# EAGLE design working (EAGLE 6.5.0)
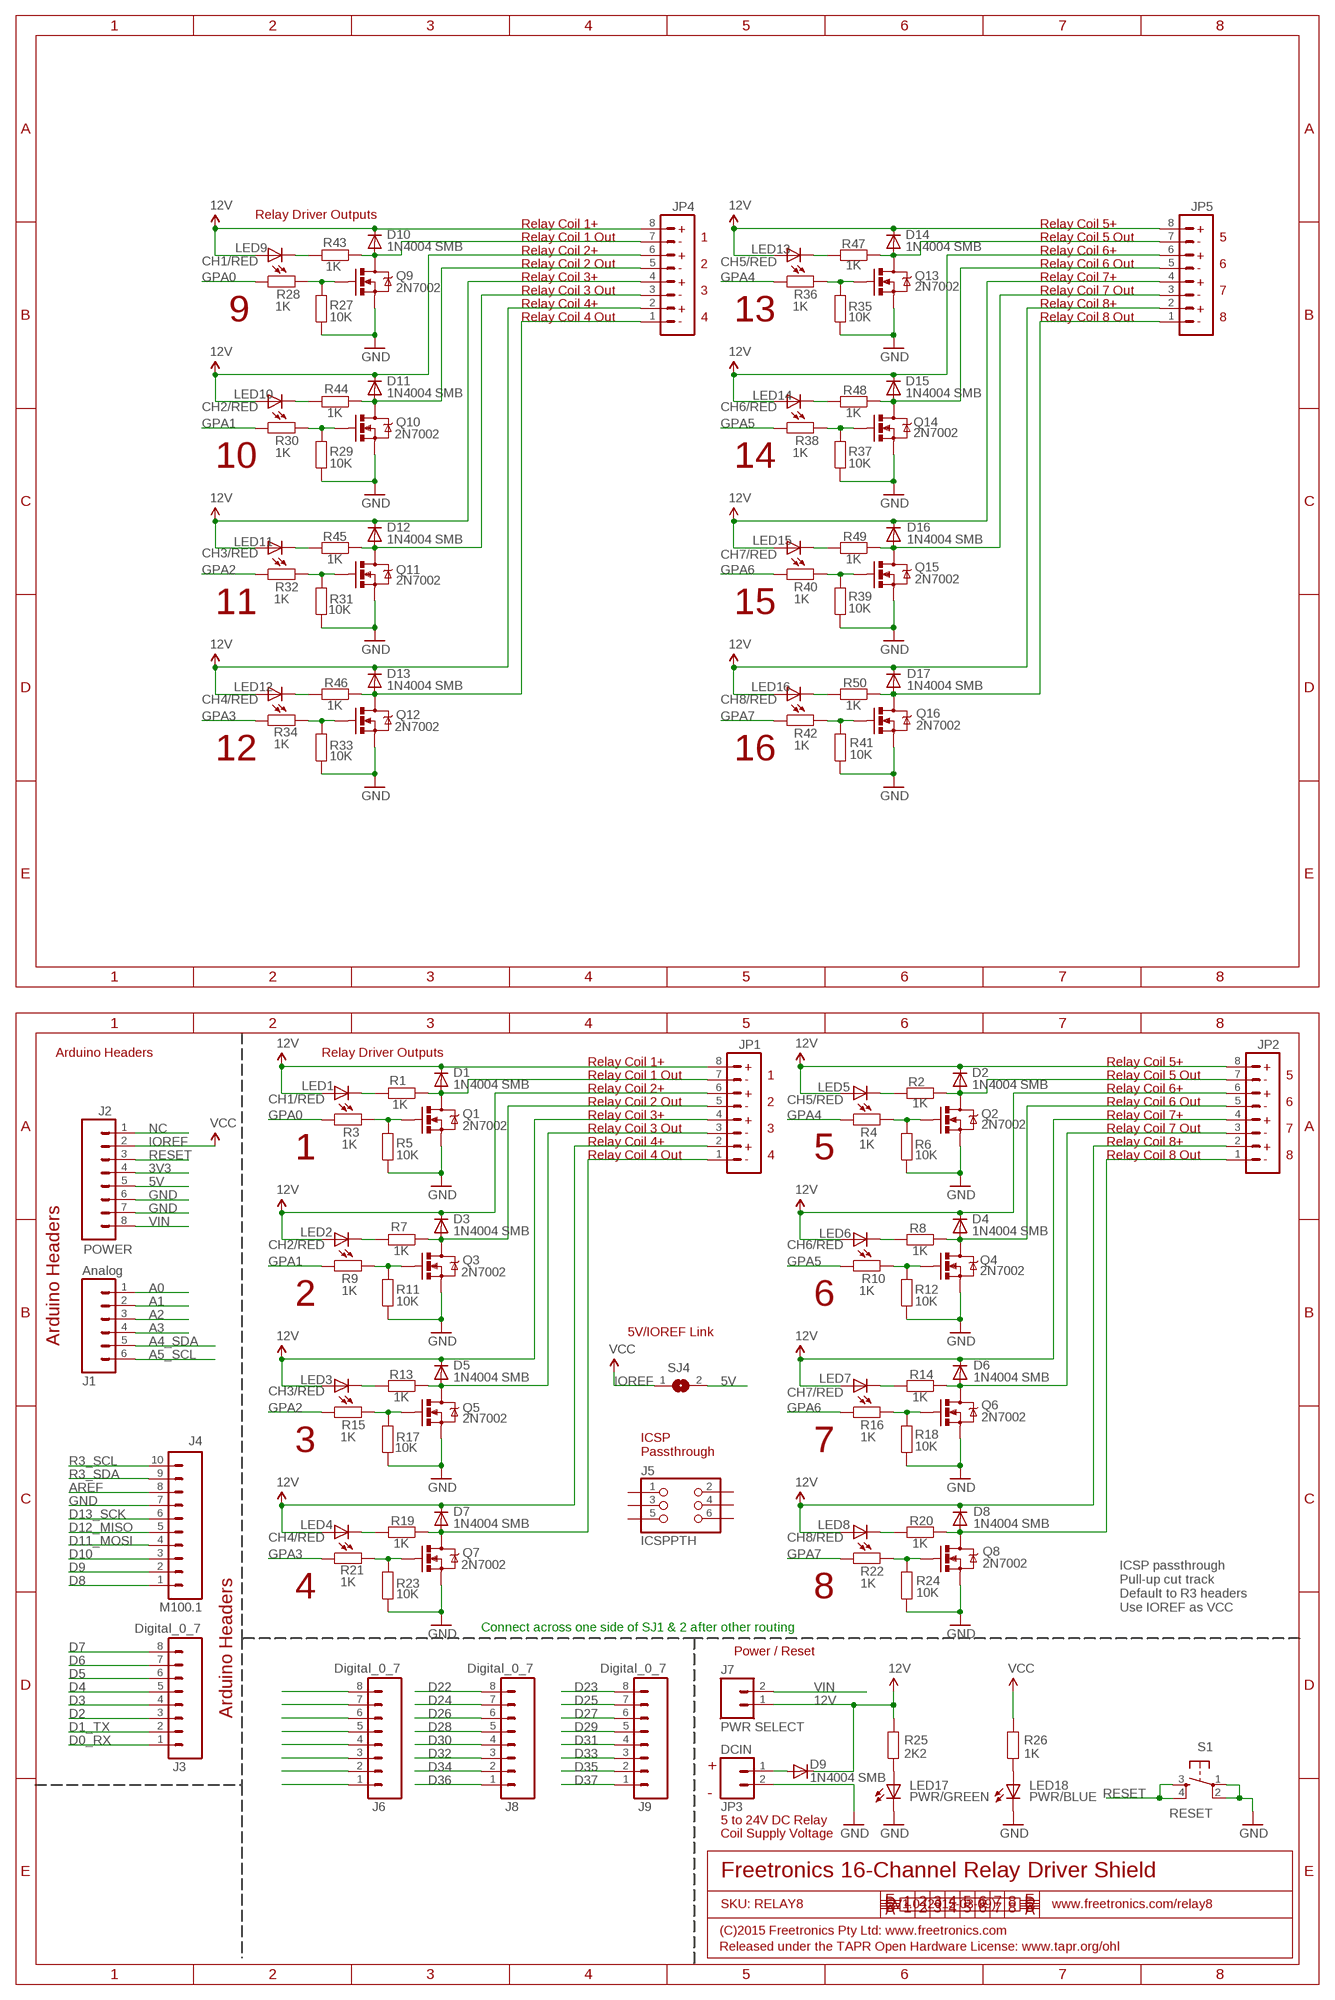
[diagram p0: schematic, sheet 1]

## Parts
D1  1N4004 SMB  DIODESMB  [SMB-DIODE]
D2  1N4004 SMB  DIODESMB  [SMB-DIODE]
D3  1N4004 SMB  DIODESMB  [SMB-DIODE]
D4  1N4004 SMB  DIODESMB  [SMB-DIODE]
D5  1N4004 SMB  DIODESMB  [SMB-DIODE]
D6  1N4004 SMB  DIODESMB  [SMB-DIODE]
D7  1N4004 SMB  DIODESMB  [SMB-DIODE]
D8  1N4004 SMB  DIODESMB  [SMB-DIODE]
D9  1N4004 SMB  DIODESMB  [SMB-DIODE]
D10  1N4004 SMB  DIODESMB  [SMB-DIODE]
D11  1N4004 SMB  DIODESMB  [SMB-DIODE]
D12  1N4004 SMB  DIODESMB  [SMB-DIODE]
D13  1N4004 SMB  DIODESMB  [SMB-DIODE]
D14  1N4004 SMB  DIODESMB  [SMB-DIODE]
D15  1N4004 SMB  DIODESMB  [SMB-DIODE]
D16  1N4004 SMB  DIODESMB  [SMB-DIODE]
D17  1N4004 SMB  DIODESMB  [SMB-DIODE]
J1  Analog  M06SIP  [1X06]
J2  POWER  M08  [1X08]
J3  Digital_0_7  M08  [1X08]
J4  M100.1  [1X10]
J5  ICSPPTH  [2X03PTH]
J6  Digital_0_7  M08  [1X08]
J7  PWR SELECT  M02PTH  [1X02]
J8  Digital_0_7  M08  [1X08]
J9  Digital_0_7  M08  [1X08]
JP1  M08  [TERMINALBLOCK_3.5MM_8]
JP2  M08  [TERMINALBLOCK_3.5MM_8]
JP3  DCIN  M023.5MM  [SCREWTERMINAL-3.5MM-2]
JP4  M08  [TERMINALBLOCK_3.5MM_8]
JP5  M08  [TERMINALBLOCK_3.5MM_8]
LED1  CH1/RED  LED0603  [LED-0603]
LED2  CH2/RED  LED0603  [LED-0603]
LED3  CH3/RED  LED0603  [LED-0603]
LED4  CH4/RED  LED0603  [LED-0603]
LED5  CH5/RED  LED0603  [LED-0603]
LED6  CH6/RED  LED0603  [LED-0603]
LED7  CH7/RED  LED0603  [LED-0603]
LED8  CH8/RED  LED0603  [LED-0603]
LED9  CH1/RED  LED0603  [LED-0603]
LED10  CH2/RED  LED0603  [LED-0603]
LED11  CH3/RED  LED0603  [LED-0603]
LED12  CH4/RED  LED0603  [LED-0603]
LED13  CH5/RED  LED0603  [LED-0603]
LED14  CH6/RED  LED0603  [LED-0603]
LED15  CH7/RED  LED0603  [LED-0603]
LED16  CH8/RED  LED0603  [LED-0603]
LED17  PWR/GREEN  LED0603  [LED-0603]
LED18  PWR/BLUE  LED0603  [LED-0603]
Q1  2N7002  MOSFET-NCHANNELSMD  [SOT23-3]
Q2  2N7002  MOSFET-NCHANNELSMD  [SOT23-3]
Q3  2N7002  MOSFET-NCHANNELSMD  [SOT23-3]
Q4  2N7002  MOSFET-NCHANNELSMD  [SOT23-3]
Q5  2N7002  MOSFET-NCHANNELSMD  [SOT23-3]
Q6  2N7002  MOSFET-NCHANNELSMD  [SOT23-3]
Q7  2N7002  MOSFET-NCHANNELSMD  [SOT23-3]
Q8  2N7002  MOSFET-NCHANNELSMD  [SOT23-3]
Q9  2N7002  MOSFET-NCHANNELSMD  [SOT23-3]
Q10  2N7002  MOSFET-NCHANNELSMD  [SOT23-3]
Q11  2N7002  MOSFET-NCHANNELSMD  [SOT23-3]
Q12  2N7002  MOSFET-NCHANNELSMD  [SOT23-3]
Q13  2N7002  MOSFET-NCHANNELSMD  [SOT23-3]
Q14  2N7002  MOSFET-NCHANNELSMD  [SOT23-3]
Q15  2N7002  MOSFET-NCHANNELSMD  [SOT23-3]
Q16  2N7002  MOSFET-NCHANNELSMD  [SOT23-3]
R1  1K  RESISTOR0603  [0603]
R2  1K  RESISTOR0603  [0603]
R3  1K  RESISTOR0603  [0603]
R4  1K  RESISTOR0603  [0603]
R5  10K  RESISTOR0603  [0603]
R6  10K  RESISTOR0603  [0603]
R7  1K  RESISTOR0603  [0603]
R8  1K  RESISTOR0603  [0603]
R9  1K  RESISTOR0603  [0603]
R10  1K  RESISTOR0603  [0603]
R11  10K  RESISTOR0603  [0603]
R12  10K  RESISTOR0603  [0603]
R13  1K  RESISTOR0603  [0603]
R14  1K  RESISTOR0603  [0603]
R15  1K  RESISTOR0603  [0603]
R16  1K  RESISTOR0603  [0603]
R17  10K  RESISTOR0603  [0603]
R18  10K  RESISTOR0603  [0603]
R19  1K  RESISTOR0603  [0603]
R20  1K  RESISTOR0603  [0603]
R21  1K  RESISTOR0603  [0603]
R22  1K  RESISTOR0603  [0603]
R23  10K  RESISTOR0603  [0603]
R24  10K  RESISTOR0603  [0603]
R25  2K2  RESISTOR0603  [0603]
R26  1K  RESISTOR0603  [0603]
R27  10K  RESISTOR0603  [0603]
R28  1K  RESISTOR0603  [0603]
R29  10K  RESISTOR0603  [0603]
R30  1K  RESISTOR0603  [0603]
R31  10K  RESISTOR0603  [0603]
R32  1K  RESISTOR0603  [0603]
R33  10K  RESISTOR0603  [0603]
R34  1K  RESISTOR0603  [0603]
R35  10K  RESISTOR0603  [0603]
R36  1K  RESISTOR0603  [0603]
R37  10K  RESISTOR0603  [0603]
R38  1K  RESISTOR0603  [0603]
R39  10K  RESISTOR0603  [0603]
R40  1K  RESISTOR0603  [0603]
R41  10K  RESISTOR0603  [0603]
R42  1K  RESISTOR0603  [0603]
R43  1K  RESISTOR0603  [0603]
R44  1K  RESISTOR0603  [0603]
R45  1K  RESISTOR0603  [0603]
R46  1K  RESISTOR0603  [0603]
R47  1K  RESISTOR0603  [0603]
R48  1K  RESISTOR0603  [0603]
R49  1K  RESISTOR0603  [0603]
R50  1K  RESISTOR0603  [0603]
S1  RESET  TAC_SWITCHSMD  [TACTILE_SWITCH_SMD]
SJ4  SJN  [SJ]

## Nets
3V3: J2.4
5V: J2.5 SJ4.2
12V: D1.C D2.C D3.C D4.C D5.C D6.C D7.C D8.C D9.C D10.C D11.C D12.C D13.C D14.C D15.C D16.C D17.C J7.1 JP1.2 JP1.4 JP1.6 JP1.8 JP2.2 JP2.4 JP2.6 JP2.8 JP4.2 JP4.4 JP4.6 JP4.8 JP5.2 JP5.4 JP5.6 JP5.8 LED1.A LED2.A LED3.A LED4.A LED5.A LED6.A LED7.A LED8.A LED9.A LED10.A LED11.A LED12.A LED13.A LED14.A LED15.A LED16.A R25.2
A0: J1.1
A1: J1.2
A2: J1.3
A3: J1.4
A4_SDA: J1.5
A5_SCL: J1.6
AREF: J4.8
D0_RX: J3.1
D1_TX: J3.2
D2: J3.3
D3: J3.4
D4: J3.5
D5: J3.6
D6: J3.7
D7: J3.8
D8: J4.1
D9: J4.2
D10: J4.3
D11_MOSI: J4.4
D12_MISO: J4.5
D13_SCK: J4.6
D22: J8.8
D23: J9.8
D24: J8.7
D25: J9.7
D26: J8.6
D27: J9.6
D28: J8.5
D29: J9.5
D30: J8.4
D31: J9.4
D32: J8.3
D33: J9.3
D34: J8.2
D35: J9.2
D36: J8.1
D37: J9.1
GND: J2.6 J2.7 J4.7 JP3.2 LED17.C LED18.C Q1.2(S) Q2.2(S) Q3.2(S) Q4.2(S) Q5.2(S) Q6.2(S) Q7.2(S) Q8.2(S) Q9.2(S) Q10.2(S) Q11.2(S) Q12.2(S) Q13.2(S) Q14.2(S) Q15.2(S) Q16.2(S) R5.1 R6.1 R11.1 R12.1 R17.1 R18.1 R23.1 R24.1 R27.1 R29.1 R31.1 R33.1 R35.1 R37.1 R39.1 R41.1 S1.1 S1.2
GPA0: R3.2 R28.2
GPA1: R9.2 R30.2
GPA2: R15.2 R32.2
GPA3: R21.2 R34.2
GPA4: R4.2 R36.2
GPA5: R10.2 R38.2
GPA6: R16.2 R40.2
GPA7: R22.2 R42.2
IOREF: J2.2 R26.2 SJ4.1 ; supply symbol labelled VCC
N$1: Q1.1(G) R3.1 R5.2
N$3: D3.A JP1.5 Q3.3(D) R7.2
N$4: LED17.A R25.1
N$5: D1.A JP1.7 Q1.3(D) R1.2
N$8: Q3.1(G) R9.1 R11.2
N$9: D5.A JP1.3 Q5.3(D) R13.2
N$10: Q5.1(G) R15.1 R17.2
N$11: D7.A JP1.1 Q7.3(D) R19.2
N$12: Q7.1(G) R21.1 R23.2
N$13: D2.A JP2.7 Q2.3(D) R2.2
N$14: Q2.1(G) R4.1 R6.2
N$15: D4.A JP2.5 Q4.3(D) R8.2
N$16: Q4.1(G) R10.1 R12.2
N$17: D6.A JP2.3 Q6.3(D) R14.2
N$18: Q6.1(G) R16.1 R18.2
N$19: D8.A JP2.1 Q8.3(D) R20.2
N$20: Q8.1(G) R22.1 R24.2
N$21: LED2.C R7.1
N$22: LED4.C R19.1
N$23: LED3.C R13.1
N$24: LED1.C R1.1
N$25: LED5.C R2.1
N$26: LED6.C R8.1
N$27: LED7.C R14.1
N$28: LED8.C R20.1
N$41: D9.A JP3.1
N$42: D10.A JP4.7 Q9.3(D) R43.2
N$43: Q9.1(G) R27.2 R28.1
N$47: D11.A JP4.5 Q10.3(D) R44.2
N$48: Q10.1(G) R29.2 R30.1
N$50: D12.A JP4.3 Q11.3(D) R45.2
N$51: Q11.1(G) R31.2 R32.1
N$52: LED18.A R26.1
N$53: D13.A JP4.1 Q12.3(D) R46.2
N$54: Q12.1(G) R33.2 R34.1
N$55: D14.A JP5.7 Q13.3(D) R47.2
N$56: Q13.1(G) R35.2 R36.1
N$57: D15.A JP5.5 Q14.3(D) R48.2
N$58: Q14.1(G) R37.2 R38.1
N$59: D16.A JP5.3 Q15.3(D) R49.2
N$60: Q15.1(G) R39.2 R40.1
N$61: D17.A JP5.1 Q16.3(D) R50.2
N$62: Q16.1(G) R41.2 R42.1
N$63: LED9.C R43.1
N$64: LED10.C R44.1
N$65: LED11.C R45.1
N$66: LED12.C R46.1
N$67: LED13.C R47.1
N$68: LED14.C R48.1
N$69: LED15.C R49.1
N$70: LED16.C R50.1
N$71: J6.8
N$72: J6.7
N$73: J6.6
N$74: J6.5
N$75: J6.4
N$76: J6.3
N$77: J6.2
N$78: J6.1
NC: J2.1
R3_SCL: J4.10
R3_SDA: J4.9
RESET: J2.3 S1.3 S1.4
VIN: J2.8 J7.2
Unconnected: J5.1 J5.2 J5.3 J5.4 J5.5 J5.6

## Notes on the sheet
- Relay Driver Outputs
- Relay Coil 1+ | Relay Coil 5+
- + | +
- Relay Coil 1 Out | 1 | Relay Coil 5 Out | 5
- - | -
- Relay Coil 2+ | Relay Coil 6+
- + | +
- Relay Coil 2 Out | 2 | Relay Coil 6 Out | 6
- - | -
- Relay Coil 3+ | Relay Coil 7+
- + | +
- Relay Coil 3 Out | 3 | Relay Coil 7 Out | 7
- - | -
- Relay Coil 4+ | Relay Coil 8+
- + | +
- 9 | Relay Coil 4 Out | 4 | 13 | Relay Coil 8 Out | 8
- - | -
- 10 | 14
- 11 | 15
- 12 | 16
- Arduino Headers | Relay Driver Outputs
- Relay Coil 1+ | Relay Coil 5+
- + | +
- Relay Coil 1 Out | 1 | Relay Coil 5 Out | 5
- - | -
- Relay Coil 2+ | Relay Coil 6+
- + | +
- Relay Coil 2 Out | 2 | Relay Coil 6 Out | 6
- - | -
- Relay Coil 3+ | Relay Coil 7+
- + | +
- Relay Coil 3 Out | 3 | Relay Coil 7 Out | 7
- - | -
- Relay Coil 4+ | Relay Coil 8+
- + | +
- 1 | Relay Coil 4 Out | 4 | 5 | Relay Coil 8 Out | 8
- - | -
- 2 | 6
- 5V/IOREF Link
- Arduino Headers
- 3 | 7
- ICSP
  Passthrough
- 4 | 8
- ICSP passthrough
  Pull-up cut track
  Default to R3 headers
  Use IOREF as VCC
- Connect across one side of SJ1 & 2 after other routing
- Power / Reset
- Arduino Headers
- +
- -
- 5 to 24V DC Relay
- Coil Supply Voltage
- Freetronics 16-Channel Relay Driver Shield
- SKU: RELAY8 | V1.0 (2015-03-09) | www.freetronics.com/relay8
- (C)2015 Freetronics Pty Ltd: www.freetronics.com
- Released under the TAPR Open Hardware License: www.tapr.org/ohl

## Library data of the parts
D1-D17 = freetronics-master-v1.1:DIODE: Diode These are standard reverse protection diodes and small signal diodes. SMA package can handle up to about 1A. SOD-323 can handle about 200mA. What the SOD-323 package when ordering, there are some mfgs out there that are 5-pin packages.
J1 = freetronics:M06: Header 6 Standard 6-pin 0.1" header. Use with straight break away headers (SKU : PRT-00116), right angle break away headers (PRT-00553), swiss pins (PRT-00743), machine pins (PRT-00117), and female headers (PRT-00115). Molex polarized connector foot print use with SKU : PRT-08094 with associated crimp pins and housings. NOTES ON THE VARIANTS LOCK and LOCK_LONGPADS... This footprint was designed to help hold the alignment of a through-hole component (i.e. 6-pin header) while soldering it into place. You may notice that each hole has been shifted either up or down by 0.005 of an inch from it's more standard position (which is a perfectly straight line). This slight alteration caused the pins (the squares in the middle) to touch the edges of the holes. Because they are alternating, it causes a "brace" to hold the component in place. 0.005 has proven to be the perfect amount of "off-center" position when using our standard breakaway headers. Although looks a little odd when you look at the bare footprint, once you have a header in there, the alteration is very hard to notice. Also, if you push a header all the way into place, it is covered up entirely on the bottom side. This idea of altering the position of holes to aid alignment will be further integrated into the Sparkfun Library for other footprints. It can help hold any component with 3 or more connection pins.
J2 J3 J6 J8 J9 = freetronics:M08: Header 8 Standard 8-pin 0.1" header. Use with straight break away headers (SKU : PRT-00116), right angle break away headers (PRT-00553), swiss pins (PRT-00743), machine pins (PRT-00117), and female headers (PRT-00115).
J4 = freetronics-original:M10: Header 10 Standard 10-pin 0.1" header. Use with straight break away headers (SKU : PRT-00116), right angle break away headers (PRT-00553), swiss pins (PRT-00743), machine pins (PRT-00117), and female headers (PRT-00115).
J5 = freetronics-jon:ICSP
J7 = SparkFun:M02: Header 2 Standard 2-pin 0.1" header. Use with straight break away headers (SKU : PRT-00116), right angle break away headers (PRT-00553), swiss pins (PRT-00743), machine pins (PRT-00117), and female headers (PRT-00115). Molex polarized connector foot print use with SKU : PRT-08233 with associated crimp pins and housings.
JP1 JP2 JP4 JP5 = freetronics-master-v1:M08: Header 8 Standard 8-pin 0.1" header. Use with straight break away headers (SKU : PRT-00116), right angle break away headers (PRT-00553), swiss pins (PRT-00743), machine pins (PRT-00117), and female headers (PRT-00115).
JP3 = freetronics-master-v1.1:M02: Header 2 Standard 2-pin 0.1" header. Use with straight break away headers (SKU : PRT-00116), right angle break away headers (PRT-00553), swiss pins (PRT-00743), machine pins (PRT-00117), and female headers (PRT-00115). Molex polarized connector foot print use with SKU : PRT-08233 with associated crimp pins and housings.
LED1-LED18 = freetronics-master-v1:LED: LEDs Standard schematic elements and footprints for 5mm, 3mm, 1206, and 0603 sized LEDs. 5mm - Spark Fun Electronics SKU : COM-00529 (and others)
Q1-Q16 = freetronics-master-v1:MOSFET-NCHANNEL
R1-R50 = freetronics-master-v1:RESISTOR: Resistor Basic schematic elements and footprints for 0603, 1206, and PTH 1/10th watt (small) resistors.
S1 = freetronics-original:TAC_SWITCH: Momentary Switch Button commonly used for reset or general input. Spark Fun Electronics SKU : COM-00097
SJ4 = freetronics-jon:SJ: SMD solder JUMPER

## Board
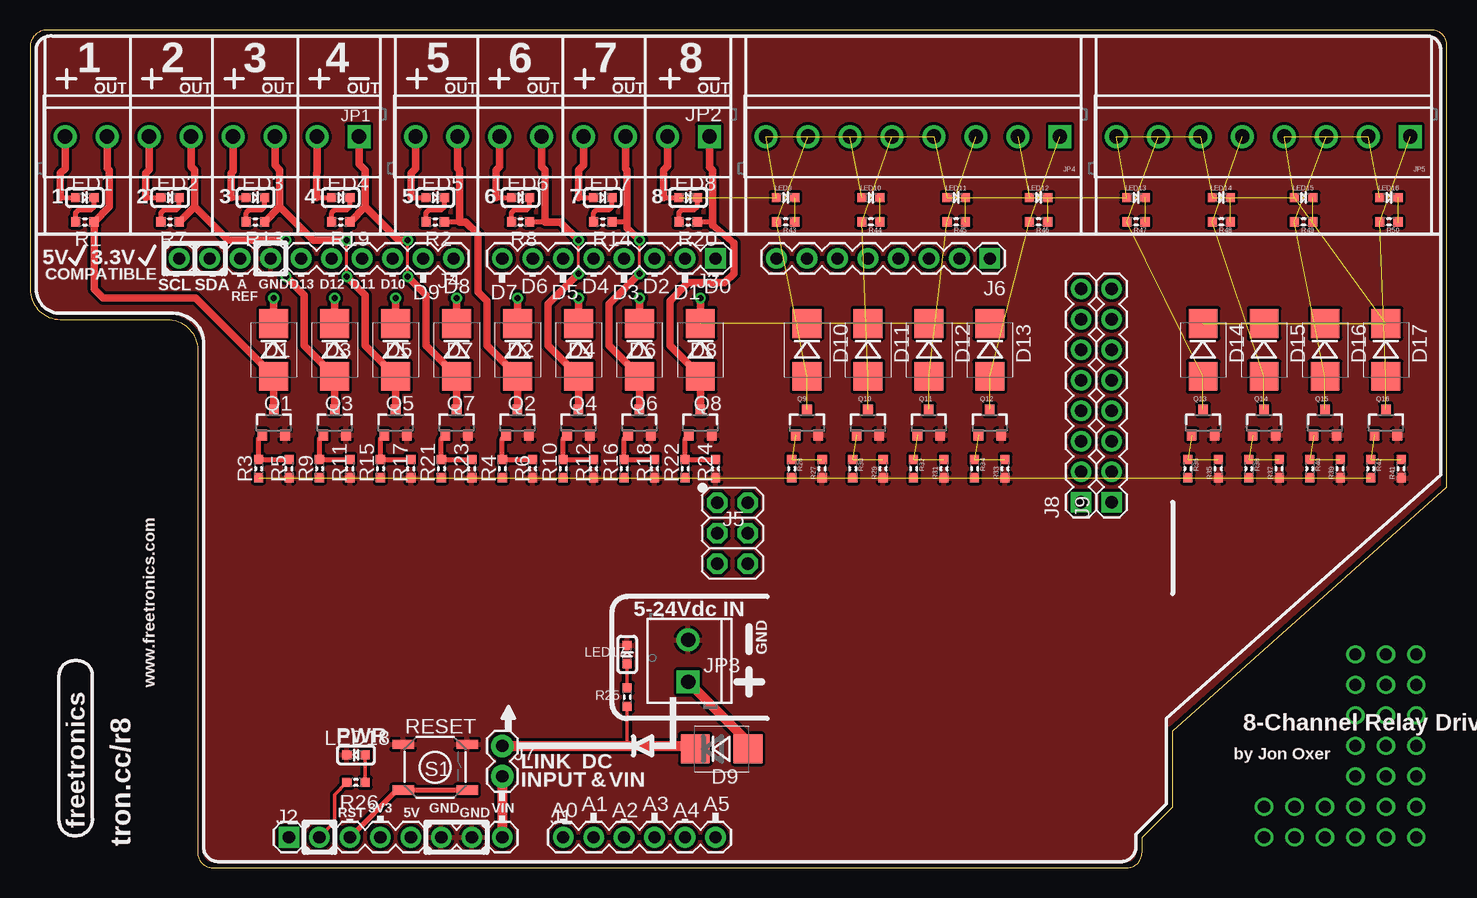
[diagram p1: board, top side]
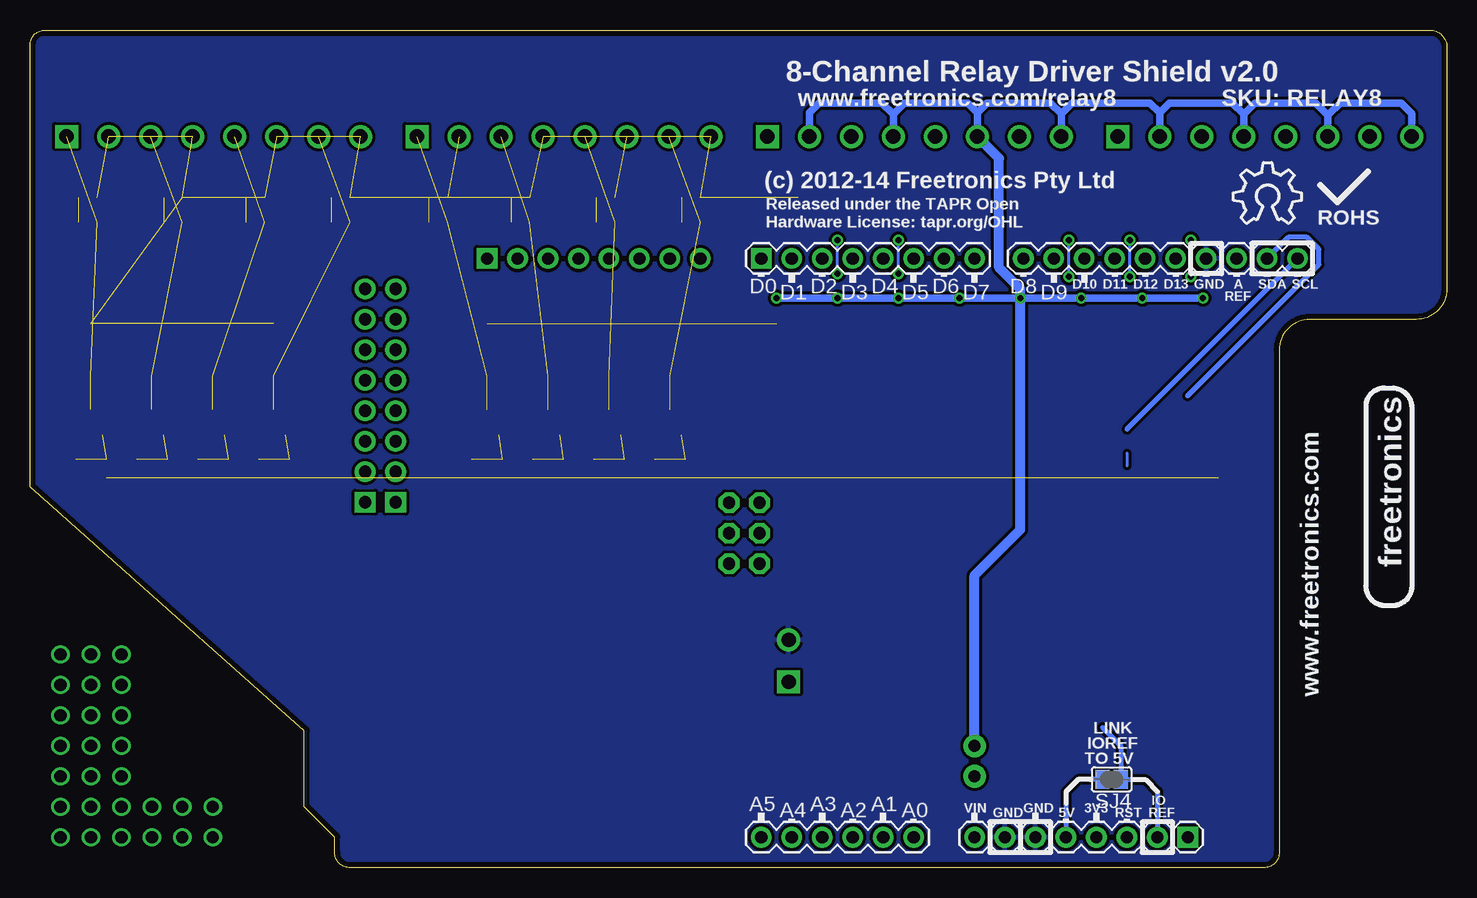
[diagram p2: board, bottom side, seen from below]

Size 118.11 x 69.85 mm. Coordinates in mm from the lower left corner, seen from the top.
Outline: 13.97,1.27 arc90 15.24,0 91.44,0 arc90 92.71,1.27 92.71,2.54 95.25,5.08 95.25,11.43 118.11,31.75 118.11,68.58 arc90 116.84,69.85 1.27,69.85 arc74 0,68.58 0,48.26 arc90 2.54,45.72 11.43,45.72 arc-90 13.97,43.18 13.97,1.27
Copper layers (1*16): Top 0.035mm / dielectric 1.5mm / Bottom 0.035mm
Design rules "default *": minimum track width 10mil, minimum drill 19mil, track to track 10mil, track to pad 12mil, pad to pad 12mil, via to via 12mil, smd to smd 8mil, copper to edge 18mil, drill to drill 8mil, minimum pad ring 14mil, minimum via ring 8mil, stop-mask expansion 4mil, vias tented up to drill 0mil, thermal gap 10mil

### Footprints (pad centres in the part's own frame; a part is rotated, then mirrored left to right if it is on the bottom)
SMB-DIODE = smd 2.4 x 2.4: A 2.2,0; C -2.2,0
1X06 = drill 1.016: 1 0,0; 2 2.54,0; 3 5.08,0; 4 7.62,0; 5 10.16,0; 6 12.7,0
1X08 = drill 1.016 square: 1 0,0 | drill 1.016: 2 2.54,0; 3 5.08,0; 4 7.62,0; 5 10.16,0; 6 12.7,0; 7 15.24,0; 8 17.78,0
1X10 = drill 1.016: 1 0,0; 2 2.54,0; 3 5.08,0; 4 7.62,0; 5 10.16,0; 6 12.7,0; 7 15.24,0; 8 17.78,0; 9 20.32,0; 10 22.86,0
2X03PTH = drill 1.016 octagon: 1 -2.54,-1.27; 2 -2.54,1.27; 3 0,-1.27; 4 0,1.27; 5 2.54,-1.27; 6 2.54,1.27
1X02 = drill 1.016 pad 1.88: 1 0,0; 2 2.54,0
TERMINALBLOCK_3.5MM_8 = drill 1.2 square: 1 0,0 | drill 1.2: 2 3.5,0; 3 7,0; 4 10.5,0; 5 14,0; 6 17.5,0; 7 21,0; 8 24.5,0
SCREWTERMINAL-3.5MM-2 = drill 1.2 square: 1 0,0 | drill 1.2: 2 3.5,0
LED-0603 = smd 0.762 x 0.762: A -0.762,0; C 0.762,0
SOT23-3 = smd 0.8 x 0.9: 1 -0.95,-1; 2 0.95,-1; 3 0,1.1
0603 = smd 0.762 x 0.762: 1 -0.762,0; 2 0.762,0
TACTILE_SWITCH_SMD = smd 1.778 x 0.762: 1 -2.667,1.905; 2 2.667,1.905; 3 -2.667,-1.905; 4 2.667,-1.905
SJ = smd 1.168 x 1.6: 1 -0.762,0; 2 0.762,0

### Placement (x,y rotation side)
D1  20.32,43.18 270 top
D2  40.64,43.18 270 top
D3  25.4,43.18 270 top
D4  45.72,43.18 270 top
D5  30.48,43.18 270 top
D6  50.8,43.18 270 top
D7  35.56,43.18 270 top
D8  55.88,43.18 270 top
D9  57.66,9.91 0 top
D10  64.77,43.18 270 top
D11  69.85,43.18 270 top
D12  74.93,43.18 270 top
D13  80.01,43.18 270 top
D14  97.79,43.18 270 top
D15  102.87,43.18 270 top
D16  107.95,43.18 270 top
D17  113.03,43.18 270 top
J1  44.45,2.54 0 top
J2  21.59,2.54 0 top
J3  57.15,50.8 180 top
J4  35.31,50.8 180 top
J5  58.56,27.89 270 top
J6  80.01,50.8 180 top
J7  39.37,10.16 270 top
J8  87.63,30.48 90 top
J9  90.17,30.48 90 top
JP1  27.43,60.96 180 top
JP2  56.64,60.96 180 top
JP3  54.86,15.49 90 top
JP4  85.85,60.96 180 top
JP5  115.06,60.96 180 top
LED1  4.57,55.88 0 top
LED2  11.68,55.88 0 top
LED3  18.8,55.88 0 top
LED4  25.91,55.88 0 top
LED5  33.78,55.88 0 top
LED6  40.89,55.88 0 top
LED7  47.75,55.88 0 top
LED8  54.86,55.88 0 top
LED9  62.99,55.88 0 top
LED10  70.1,55.88 0 top
LED11  77.22,55.88 0 top
LED12  84.07,55.88 0 top
LED13  92.2,55.88 0 top
LED14  99.31,55.88 0 top
LED15  106.17,55.88 0 top
LED16  113.28,55.88 0 top
LED17  49.78,17.78 90 top
LED18  27.18,9.4 180 top
Q1  20.32,37.08 0 top
Q2  40.64,37.08 0 top
Q3  25.4,37.08 0 top
Q4  45.72,37.08 0 top
Q5  30.48,37.08 0 top
Q6  50.8,37.08 0 top
Q7  35.56,37.08 0 top
Q8  55.88,37.08 0 top
Q9  64.77,37.08 0 top
Q10  69.85,37.08 0 top
Q11  74.93,37.08 0 top
Q12  80.01,37.08 0 top
Q13  97.79,37.08 0 top
Q14  102.87,37.08 0 top
Q15  107.95,37.08 0 top
Q16  113.03,37.08 0 top
R1  4.57,53.85 0 top
R2  33.78,53.85 0 top
R3  19.05,33.27 270 top
R4  39.37,33.27 270 top
R5  21.59,33.27 90 top
R6  41.91,33.27 90 top
R7  11.68,53.85 0 top
R8  40.89,53.85 0 top
R9  24.13,33.27 270 top
R10  44.45,33.27 270 top
R11  26.67,33.27 90 top
R12  46.99,33.27 90 top
R13  18.8,53.85 0 top
R14  47.75,53.85 0 top
R15  29.21,33.27 270 top
R16  49.53,33.27 270 top
R17  31.75,33.27 90 top
R18  52.07,33.27 90 top
R19  25.91,53.85 0 top
R20  54.86,53.85 0 top
R21  34.29,33.27 270 top
R22  54.61,33.27 270 top
R23  36.83,33.27 90 top
R24  57.15,33.27 90 top
R25  49.78,14.22 270 top
R26  27.18,7.11 180 top
R27  66.04,33.27 90 top
R28  63.5,33.27 270 top
R29  71.12,33.27 90 top
R30  68.58,33.27 270 top
R31  76.2,33.27 90 top
R32  73.66,33.27 270 top
R33  81.28,33.27 90 top
R34  78.74,33.27 270 top
R35  99.06,33.27 90 top
R36  96.52,33.27 270 top
R37  104.14,33.27 90 top
R38  101.6,33.27 270 top
R39  109.22,33.27 90 top
R40  106.68,33.27 270 top
R41  114.3,33.27 90 top
R42  111.76,33.27 270 top
R43  62.99,53.85 180 top
R44  70.1,53.85 180 top
R45  77.22,53.85 180 top
R46  84.07,53.85 180 top
R47  92.2,53.85 180 top
R48  99.31,53.85 180 top
R49  106.17,53.85 180 top
R50  113.28,53.85 180 top
S1  33.78,8.38 0 top
SJ4  27.94,7.37 180 bottom
U$6  [OSHW_10X200_NOTEXT]  17.78,53.72 0 bottom

### Tracks (layer width: path | path; a pad name or v marks a point on that pad's centre or on a via)
5V
  Bottom 0.406: SJ4.2 30.73,7.37 31.75,6.35 J2.5
12V  (via drill 0.5)  (24 unrouted)
  Top 0.305: R25.2 49.78,10.16
  Top 0.406: 2.54,55.88 LED1.A | 9.65,55.88 LED2.A | 16.76,55.88 LED3.A | 23.88,55.88 LED4.A | 31.75,55.88 LED5.A | 38.86,55.88 LED6.A | 52.83,55.88 LED8.A | 45.72,55.88 LED7.A
  Top 0.61: 2.54,55.88 2.54,57.91 2.93,58.3 JP1.8 | 9.65,55.88 9.65,57.91 9.93,58.19 JP1.6 | 16.76,55.88 16.76,57.91 16.93,58.08 JP1.4 | 23.88,55.88 23.88,57.91 23.93,57.97 JP1.2 | 31.75,55.88 31.75,57.91 32.14,58.3 JP2.8 | 52.83,55.88 52.83,58.17 53.14,58.48 JP2.2 | 45.72,55.88 45.72,58.17 46.14,58.59 JP2.4 | 38.86,55.88 38.86,58.17 39.14,58.45 JP2.6 | v20.32,47.5 D1.C | v25.4,47.5 D3.C | v30.48,47.5 D5.C | v35.56,47.5 D7.C | v40.64,47.5 D2.C | v45.72,47.5 D4.C | v50.8,47.5 D6.C | v55.88,47.5 D8.C
  Top 0.813: D9.C 55.2,10.16 49.78,10.16 J7.1
  Bottom 0.61: JP1.8 2.93,62.88 3.81,63.75 8.89,63.75 9.91,62.74 | 9.91,62.74 9.91,60.99 JP1.6 | 16.93,62.82 JP1.4 | 16.93,62.82 16,63.75 10.92,63.75 9.91,62.74 | 23.93,62.94 JP1.2 | 23.93,62.94 23.11,63.75 17.86,63.75 16.93,62.82 | 32.14,62.85 JP2.8 | 32.14,62.85 31.24,63.75 24.75,63.75 23.93,62.94 | JP2.6 39.14,62.97 | 39.14,62.97 38.35,63.75 33.04,63.75 32.14,62.85 | 46.14,62.82 JP2.4 | 46.14,62.82 45.21,63.75 39.93,63.75 39.14,62.97 | JP2.2 53.14,62.94 52.32,63.75 47.07,63.75 46.14,62.82 | v20.32,47.5 v25.4,47.5 v30.48,47.5 v35.56,47.5 v40.64,47.5 v45.72,47.5 v50.8,47.5 v55.88,47.5
  Bottom 0.813: J7.1 39.37,24.38 35.56,28.19 v35.56,47.5 35.56,48.26 37.34,50.04 37.34,59.16 JP2.6
GND
  pour Bottom: 0,68.58 arc-74 1.27,69.85 116.84,69.85 arc-74 118.11,68.58 118.11,31.75 95.25,11.43 95.25,5.08 92.71,2.54 92.71,1.27 arc-74 91.44,0 15.24,0 arc-90 13.97,1.27 13.97,43.18 arc90 11.43,45.72 2.54,45.72 arc-90 0,48.26
  pour Top: 0,68.58 arc-74 1.27,69.85 116.84,69.85 arc-74 118.11,68.58 118.11,31.75 95.25,11.43 95.25,5.08 92.71,2.54 92.71,1.27 arc-74 91.44,0 15.24,0 arc-90 13.97,1.27 13.97,43.18 arc90 11.43,45.72 2.54,45.72 arc-90 0,48.26
GPA0  (1 unrouted)
GPA1  (1 unrouted)
GPA2  (1 unrouted)
GPA3  (1 unrouted)
GPA4  (1 unrouted)
GPA5  (1 unrouted)
GPA6  (1 unrouted)
GPA7  (1 unrouted)
IOREF
  Top 0.305: R26.2 25.4,6.1 25.4,3.81 J2.2
  Bottom 0.406: 28.7,11.68 27.18,10.16 SJ4.1 25.15,7.37 24.13,6.35 J2.2
N$1
  Top 0.406: R5.2 R3.1 19.05,35.76 Q1.1 19.3,36.02
N$2  (via drill 1.02)
  other vias: 115.57,17.78
N$3  (via drill 0.5)
  Top 0.254: v21.34,49.28 v21.34,52.32
  Top 0.61: Q3.3 D3.A | D3.A 25.4,41.15 | 13.72,55.12 13.72,58.17 13.43,58.45 JP1.5 | 13.72,55.12 R7.2 | 13.72,55.12 16.51,52.32 v21.34,52.32 | D3.A 22.86,43.52 22.86,47.75 v21.34,49.28
  Bottom 0.254: v21.34,49.28 v21.34,52.32
N$4
  Top 0.305: R25.1 LED17.A
N$5
  Top 0.61: D1.A Q1.3 | D1.A 20.66,40.98 | JP1.7 6.43,58.34 6.6,58.17 6.6,55.12 R1.2 5.33,48.26 6.1,47.5 13.8,47.5 D1.A
N$6  (via drill 1.02)
  other vias: 113.03,10.16
N$7  (via drill 1.02)
  other vias: 110.49,10.16
N$8
  Top 0.406: R11.2 R9.1 24.13,35.76 Q3.1 24.38,36.02
N$9  (via drill 0.5)
  Top 0.254: v26.42,49.28 v26.42,52.32
  Top 0.61: Q5.3 D5.A | 20.83,55.12 20.83,58.17 20.43,58.56 JP1.3 | 20.83,55.12 R13.2 | D5.A 30.48,41.15 | v26.42,49.28 27.94,47.75 27.94,43.52 D5.A | 20.83,55.12 23.62,52.32 v26.42,52.32
  Bottom 0.254: v26.42,49.28 v26.42,52.32
N$10
  Top 0.406: R17.2 R15.1 29.21,35.76 Q5.1 29.46,36.02
N$11  (via drill 0.5)
  Top 0.254: v31.5,49.28 v31.5,52.32
  Top 0.61: 27.94,55.12 27.94,58.17 27.43,58.67 JP1.1 | Q7.3 D7.A | D7.A 35.56,41.15 | v31.5,49.28 33.02,47.75 33.02,43.52 D7.A | 27.94,55.12 R19.2 | 27.94,55.12 30.73,52.32 v31.5,52.32
  Bottom 0.254: v31.5,49.28 v31.5,52.32
N$12
  Top 0.406: R23.2 R21.1 34.29,35.76 Q7.1 34.54,36.02
N$13
  Top 0.406: 35.81,53.85 R2.2
  Top 0.61: Q2.3 D2.A 38.1,43.52 38.1,47.24 37.34,48.01 37.34,52.83 36.32,53.85 35.81,53.85 35.81,58.17 35.64,58.34 JP2.7
N$14
  Top 0.406: R6.2 R4.1 39.37,35.76 Q2.1
N$15  (via drill 0.5)
  Top 0.254: v45.72,49.53 v45.72,52.32
  Top 0.406: 42.93,53.85 R8.2
  Top 0.61: Q4.3 D4.A 43.18,43.52 43.18,46.99 v45.72,49.53 | JP2.5 42.64,58.45 42.93,58.17 42.93,53.85 44.2,53.85 v45.72,52.32
  Bottom 0.254: v45.72,49.53 v45.72,52.32
N$16
  Top 0.406: R12.2 R10.1 44.45,35.76 Q4.1
N$17  (via drill 0.5)
  Top 0.254: v50.8,49.53 v50.8,52.32
  Top 0.406: 49.78,53.85 R14.2
  Top 0.61: Q6.3 D6.A | D6.A 50.89,40.98 | v50.8,49.53 48.26,46.99 48.26,43.52 D6.A | JP2.3 49.64,58.31 49.78,58.17 49.78,53.85 49.78,53.34 v50.8,52.32
  Bottom 0.254: v50.8,49.53 v50.8,52.32
N$18
  Top 0.406: R18.2 R16.1 49.53,35.76 Q6.1
N$19
  Top 0.406: 56.9,53.85 R20.2
  Top 0.61: Q8.3 D8.A | D8.A 55.97,40.98 | JP2.1 56.64,58.42 56.9,58.17 56.9,53.85 56.9,53.59 58.67,52.07 58.67,49.53 57.91,48.77 54.86,48.77 53.34,47.24 53.34,43.52 D8.A
N$20
  Top 0.406: R24.2 R22.1 54.61,35.76 Q8.1
N$21
  Top 0.406: R7.1 10.92,54.61 11.18,54.86 12.19,54.86 12.45,55.12 LED2.C
N$22
  Top 0.406: R19.1 25.15,54.61 25.4,54.86 26.42,54.86 26.67,55.12 LED4.C
N$23
  Top 0.406: R13.1 18.03,54.61 18.29,54.86 19.3,54.86 19.56,55.12 LED3.C
N$24
  Top 0.406: R1.1 3.81,54.61 4.06,54.86 5.08,54.86 5.33,55.12 LED1.C
N$25
  Top 0.406: R2.1 33.02,54.61 33.27,54.86 34.29,54.86 34.54,55.12 LED5.C
N$26
  Top 0.406: R8.1 40.13,54.61 40.39,54.86 41.4,54.86 41.66,55.12 LED6.C
N$27
  Top 0.406: R14.1 46.99,54.61 47.24,54.86 48.26,54.86 48.51,55.12 LED7.C
N$28
  Top 0.406: R20.1 54.1,54.61 54.36,54.86 55.37,54.86 55.63,55.12 LED8.C
N$29  (via drill 1.02)
  other vias: 113.03,17.78
N$30  (via drill 1.02)
  other vias: 113.03,7.62
N$31  (via drill 1.02)
  other vias: 110.49,7.62
N$32  (via drill 1.02)
  other vias: 107.95,5.08
N$33  (via drill 1.02)
  other vias: 105.41,5.08
N$34  (via drill 1.02)
  other vias: 102.87,5.08
N$35  (via drill 1.02)
  other vias: 113.03,5.08
N$36  (via drill 1.02)
  other vias: 110.49,5.08
N$37  (via drill 1.02)
  other vias: 115.57,12.7
N$38  (via drill 1.02)
  other vias: 115.57,10.16
N$39  (via drill 1.02)
  other vias: 113.03,2.54
N$40  (via drill 1.02)
  other vias: 110.49,2.54
N$41
  Top 0.813: 55.03,15.49 JP3.1 59.86,10.5 D9.A
N$42  (3 unrouted)
N$43  (2 unrouted)
N$44  (via drill 1.02)
  other vias: 115.57,7.62
N$45  (via drill 1.02)
  other vias: 115.57,5.08
N$46  (via drill 1.02)
  other vias: 115.57,2.54
N$47  (3 unrouted)
N$48  (2 unrouted)
N$49
  Bottom 0.254: 26.67,34.54 26.67,33.53
N$50  (3 unrouted)
N$51  (2 unrouted)
N$52
  Top 0.305: LED18.A R26.1
N$53  (3 unrouted)
N$54  (2 unrouted)
N$55  (3 unrouted)
N$56  (2 unrouted)
N$57  (3 unrouted)
N$58  (2 unrouted)
N$59  (3 unrouted)
N$60  (2 unrouted)
N$61  (3 unrouted)
N$62  (2 unrouted)
N$63  (1 unrouted)
N$64  (1 unrouted)
N$65  (1 unrouted)
N$66  (1 unrouted)
N$67  (1 unrouted)
N$68  (1 unrouted)
N$69  (1 unrouted)
N$70  (1 unrouted)
N$125  (via drill 1.02)
  other vias: 113.03,12.7
N$126  (via drill 1.02)
  other vias: 110.49,12.7
N$140  (via drill 1.02)
  other vias: 115.57,15.24
N$141  (via drill 1.02)
  other vias: 113.03,15.24
N$142  (via drill 1.02)
  other vias: 110.49,15.24
N$156  (via drill 1.02)
  other vias: 110.49,17.78
N$157  (via drill 1.02)
  other vias: 107.95,2.54
N$158  (via drill 1.02)
  other vias: 105.41,2.54
N$159  (via drill 1.02)
  other vias: 102.87,2.54
R3_SCL
  Bottom 0.406: 26.67,36.58 J4.10
R3_SDA
  Bottom 0.406: 21.59,39.37 10.67,50.29 10.67,51.56 11.68,52.58 13.21,52.58 J4.9
RESET
  Top 0.406: S1.4 S1.3 30.99,6.6 30.73,6.6 J2.3
VIN
  Top 0.813: J7.2 J2.8

### Text on the board
tPlace: 1 | 2 | 3 | 4 | 5 | 6 | 7 | 8 | OUT | OUT | OUT | OUT | OUT | OUT | OUT | OUT | 1 | 2 | 3 | 4 | 5 | 6 | 7 | 8 | 5V | 3.3V | COMPATIBLE | SCL | SDA | A | GND | D13 | D12 | D11 | D10 | D8 | D6 | D4 | D2 | D0 | REF | D9 | D7 | D5 | D3 | D1 | 5-24Vdc IN | GND | www.freetronics.com | RESET | 8-Channel Relay Driver Shield | PWR | by Jon Oxer | LINK | DC | INPUT | & | VIN | 3V3 | GND | VIN | A1 | A3 | A5 | RST | 5V | GND | A0 | A2 | A4 | freetronics | tron.cc/r8
bPlace: 8-Channel Relay Driver Shield v2.0 | SKU: RELAY8 | www.freetronics.com/relay8 | (c) 2012-14 Freetronics Pty Ltd | ROHS | Released under the TAPR Open / Hardware License: tapr.org/OHL | SCL | SDA | A | GND | D13 | D12 | D11 | D10 | D8 | D6 | D4 | D2 | D0 | REF | D9 | D7 | D5 | D3 | D1 | freetronics | www.freetronics.com | LINK | IOREF | TO 5V | IO | 3V3 | GND | VIN | A1 | A3 | A5 | REF | RST | 5V | GND | A0 | A2 | A4
tDocu: A | K | A | K | A | K | A | K | A | K | A | K | A | K | A | K | K | A | K | A | K | A